# EAGLE design MSP430G2553IN28_Test2 (EAGLE 6.5.0)
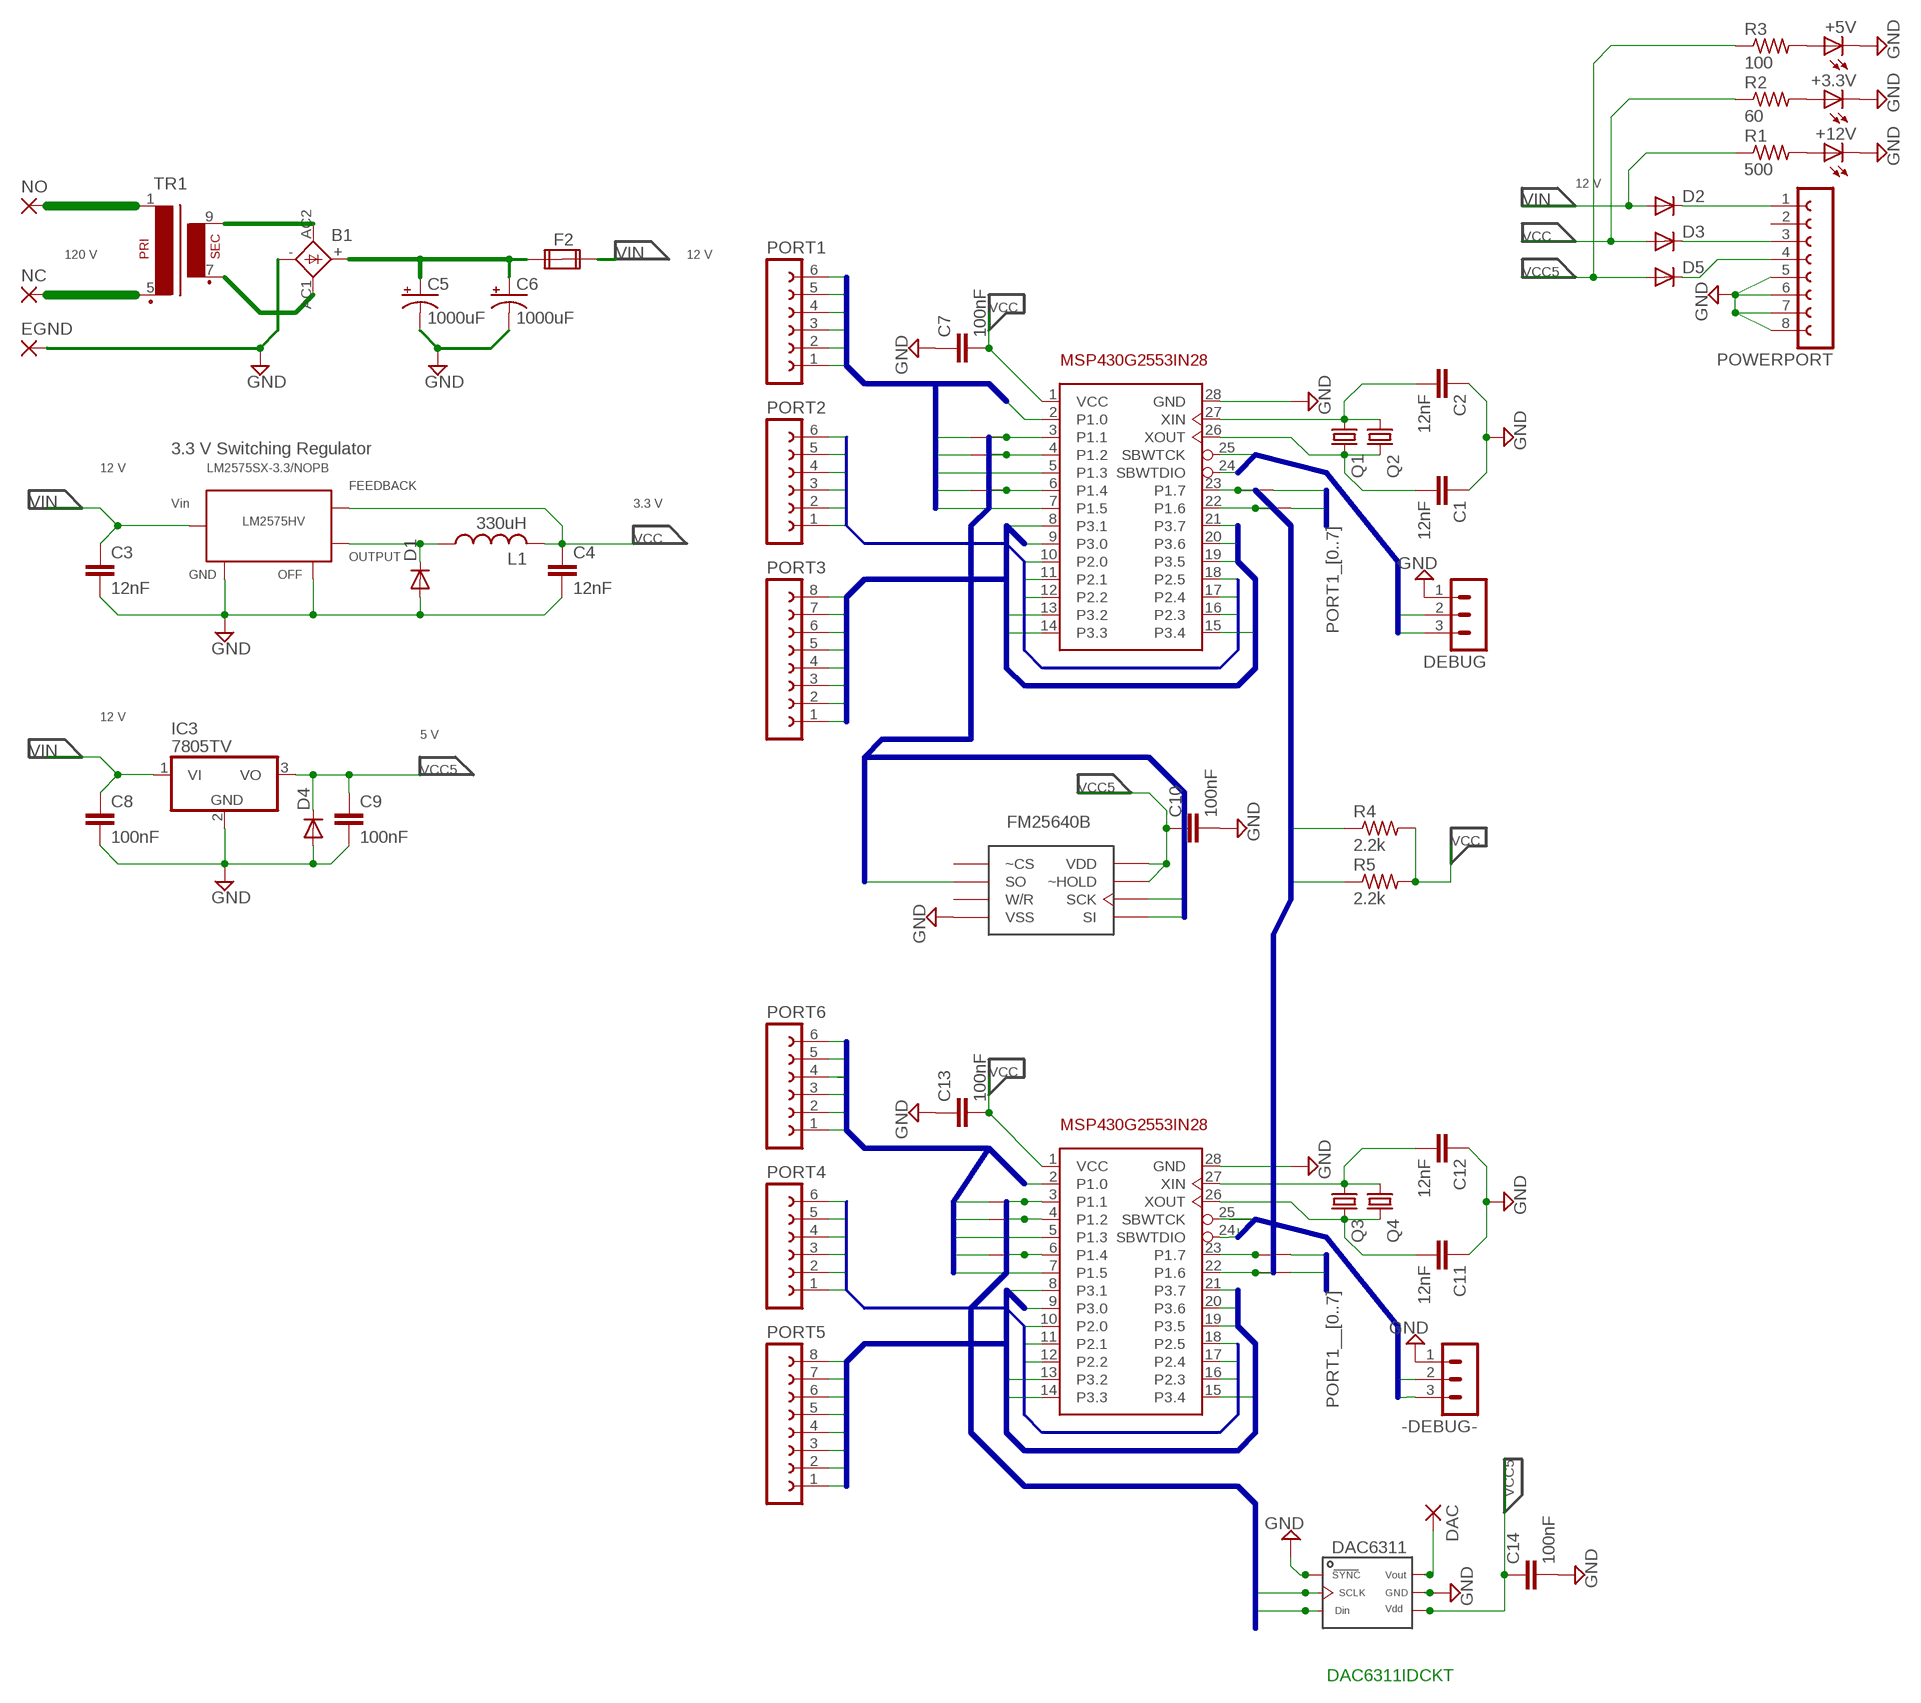
[diagram p0: schematic, sheet 1]

## Parts
+3.3V  LEDSML0603  [SML0603]
+5V  LEDSML0603  [SML0603]
+12V  LEDSML0603  [SML0603]
-DEBUG-  MA03-1  [MA03-1]
B1  GBU4  [GBU4S]
C1  12nF  C-EUC0402  [C0402]
C2  12nF  C-EUC0402  [C0402]
C3  12nF  C-EUC0402  [C0402]
C4  12nF  C-EUC0402  [C0402]
C5  1000uF  CPOL-USE5-8.5  [E5-8,5]
C6  1000uF  CPOL-USE5-8.5  [E5-8,5]
C7  100nF  C-EUC0402  [C0402]
C8  100nF  C-EUC0402  [C0402]
C9  100nF  C-EUC0402  [C0402]
C10  100nF  C-EUC0402  [C0402]
C11  12nF  C-EUC0402  [C0402]
C12  12nF  C-EUC0402  [C0402]
C13  100nF  C-EUC0402  [C0402]
C14  100nF  C-EUC0402  [C0402]
D1  DIODE-SOD106-R  [SOD106-R]
D2  DIODE-DO41-7.6  [DO41-7.6]
D3  DIODE-DO41-7.6  [DO41-7.6]
D4  DIODE-SOD106-R  [SOD106-R]
D5  DIODE-DO41-7.6  [DO41-7.6]
DAC  1,6/0,8  [1,6/0,8]
DEBUG  MA03-1  [MA03-1]
EGND  3,81/1,4  [3,81/1,4]
F2  FUSE2P  [FUSE1]
IC1  MSP430  [P-TSSOP28-1]
IC2  FM25640BSO8  [SO08]
IC3  7805TV  [TO220V]
IC4  MSP430  [P-TSSOP28-1]
IC5  DAC6311  [SC70-6]
IC6  CUSTOM_REGULATOR  [TO263-5]
L1  330uH  L-USL1812  [L1812]
NC  3,81/1,4  [3,81/1,4]
NO  3,81/1,4  [3,81/1,4]
PORT1  FE06-1  [FE06]
PORT2  FE06-1  [FE06]
PORT3  FE08-1  [FE08]
PORT4  FE06-1  [FE06]
PORT5  FE08-1  [FE08]
PORT6  FE06-1  [FE06]
POWERPORT  FE08-1  [FE08]
Q1  CRYSTALTC26H  [TC26H]
Q2  CRYSTALHC49U-V  [HC49U-V]
Q3  CRYSTALTC26H  [TC26H]
Q4  CRYSTALHC49U-V  [HC49U-V]
R1  500  R-US_R0402  [R0402]
R2  60  R-US_R0402  [R0402]
R3  100  R-US_R0402  [R0402]
R4  2.2k  R-US_R0402  [R0402]
R5  2.2k  R-US_R0402  [R0402]
TR1  VV11  [VV11]
U$1  SHORTSHORT  [SMALLSHORT]
U$6  SHORTSHORT  [SMALLSHORT]
U$7  SHORTSHORT  [SMALLSHORT]
U$8  SHORTSHORT  [SMALLSHORT]
U$9  SHORTSHORT  [SMALLSHORT]
U$10  SHORTSHORT  [SMALLSHORT]
U$11  SHORTSHORT  [SMALLSHORT]
U$12  SHORTSHORT  [SMALLSHORT]
U$13  SHORTSHORT  [SMALLSHORT]
U$14  SHORTSHORT  [SMALLSHORT]
U$15  SHORTSHORT  [SMALLSHORT]

## Nets
DEBUG_P1: DEBUG.2 IC1.25(SBWTCK)
DEBUG_P2: DEBUG.3 IC1.24(SBWTDIO)
DEBUG_P4: -DEBUG-.3 IC4.24(SBWTDIO)
DEBUG_P_2: -DEBUG-.2 IC4.25(SBWTCK)
GND: +3.3V.C +5V.C +12V.C -DEBUG-.1 B1.- C1.1 C2.1 C3.2 C4.2 C5.- C6.- C7.1 C8.2 C9.2 C10.2 C11.1 C12.1 C13.1 C14.2 D1.A D4.A DEBUG.1 EGND.1(P) IC1.28(GND) IC2.4(VSS) IC3.2(GND) IC4.28(GND) IC5.1 IC5.5 IC6.3 IC6.5 IC6.6 POWERPORT.5 POWERPORT.6 POWERPORT.7 POWERPORT.8
I2C0: IC1.23(P1.7) IC4.23(P1.7) R4.1 U$8.1 U$9.1 U$14.1
I2C1: IC1.22(P1.6) IC4.22(P1.6) R5.1 U$10.1 U$15.1
N$1: C2.2 IC1.27(XIN) Q1.1 Q2.1
N$2: C1.2 IC1.26(XOUT) Q1.2 Q2.2
N$3: NC.1(P) TR1.5(P2)
N$4: NO.1(P) TR1.1
N$5: +12V.A R1.2
N$6: +3.3V.A R2.2
N$7: D2.C POWERPORT.1
N$8: D3.C POWERPORT.3
N$9: B1.AC2(AC1) TR1.9(S4)
N$10: B1.AC1(AC2) TR1.7(S3)
N$11: C12.2 IC4.27(XIN) Q3.1 Q4.1
N$12: C11.2 IC4.26(XOUT) Q3.2 Q4.2
N$13: D5.C POWERPORT.4
N$14: +5V.A R3.2
N$15: DAC.1(P) IC5.6
N$33: B1.+ C5.+ C6.+ F2.1A
P$2: D1.C IC6.2 L1.1
PORT1_0: IC1.2(P1.0) PORT1.1
PORT1_1: PORT1.2 U$1.1
PORT1_2: PORT1.3 U$6.1
PORT1_3: IC1.5(P1.3) PORT1.4
PORT1_4: PORT1.5 U$7.1
PORT1_5: IC1.7(P1.5) PORT1.6
PORT1_6: U$10.2
PORT1_7: U$8.2 U$9.2
PORT1__0: IC4.2(P1.0) PORT6.1
PORT1__1: PORT6.2
PORT1__2: PORT6.3
PORT1__3: IC4.5(P1.3) PORT6.4
PORT1__4: PORT6.5
PORT1__5: IC4.7(P1.5) PORT6.6
PORT1__6: U$15.2
PORT1__7: U$14.2
PORT2_0: IC1.10(P2.0) PORT2.1
PORT2_1: IC1.11(P2.1) PORT2.2
PORT2_2: IC1.12(P2.2) PORT2.3
PORT2_3: IC1.16(P2.3) PORT2.4
PORT2_4: IC1.17(P2.4) PORT2.5
PORT2_5: IC1.18(P2.5) PORT2.6
PORT2_6: PORT4.1
PORT2__0: IC4.10(P2.0)
PORT2__1: IC4.11(P2.1) PORT4.2
PORT2__2: IC4.12(P2.2) PORT4.3
PORT2__3: IC4.16(P2.3) PORT4.4
PORT2__4: IC4.17(P2.4) PORT4.5
PORT2__5: IC4.18(P2.5) PORT4.6
PORT3_0: IC1.9(P3.0) PORT3.1
PORT3_1: IC1.8(P3.1) PORT3.2
PORT3_2: IC1.13(P3.2) PORT3.3
PORT3_3: IC1.14(P3.3) PORT3.4
PORT3_4: IC1.15(P3.4) PORT3.5
PORT3_5: IC1.19(P3.5) PORT3.6
PORT3_6: IC1.20(P3.6) PORT3.7
PORT3_7: IC1.21(P3.7) PORT3.8
PORT3__0: IC4.9(P3.0) PORT5.1
PORT3__1: IC4.8(P3.1) PORT5.2
PORT3__2: IC4.13(P3.2) PORT5.3
PORT3__3: IC4.14(P3.3) PORT5.4
PORT3__4: IC4.15(P3.4) PORT5.5
PORT3__5: IC4.19(P3.5) PORT5.6
PORT3__6: IC4.20(P3.6) PORT5.7
PORT3__7: IC4.21(P3.7) PORT5.8
SPI3: IC1.3(P1.1) IC2.2(SO) IC4.3(P1.1) IC5.3 U$1.2 U$11.2
SPI4: IC1.4(P1.2) IC2.5(SI) IC4.4(P1.2) U$6.2 U$12.2
SPI5: IC1.6(P1.4) IC2.6(SCK) IC4.6(P1.4) IC5.2 U$7.2 U$13.2
VCC: C4.1 C7.2 C13.2 D3.A IC1.1(VCC) IC4.1(VCC) IC6.4 L1.2 R2.1 R4.2 R5.2
VCC5: C9.1 C10.1 C14.1 D4.C D5.A IC2.7(~HOLD) IC2.8(VDD) IC3.3(VO) IC5.4 R3.1
VIN: C3.1 C8.1 D2.A F2.2A IC3.1(VI) IC6.1 R1.1
Unconnected: F2.1B F2.2B IC2.1(~CS) IC2.3(W/R) POWERPORT.2 U$11.1 U$12.1 U$13.1

## Buses
PORT1__[0..7]
PORT2__[0..5]
PORT3__[0..7]
DEBUG_P_[0..2]
I2C[0..1]
SPI[3..5]
PORT3_[0..7]
PORT2_[0..5]
PORT1_[0..7]

## Notes on the sheet
- 12 V
- 120 V | 12 V
- 3.3 V Switching Regulator
- 12 V | LM2575SX-3.3/NOPB
- 3.3 V
- 12 V
- 5 V
- DAC6311IDCKT

## Library data of the parts
+3.3V +5V +12V = led:LED: LED OSRAM: - CHIPLED LG R971, LG N971, LY N971, LG Q971, LY Q971, LO R971, LY R971 LH N974, LH R974 LS Q976, LO Q976, LY Q976 LO Q996 - Hyper CHIPLED LW Q18S LB Q993, LB Q99A, LB R99A - SideLED LS A670, LO A670, LY A670, LG A670, LP A670 LB A673, LV A673, LT A673, LW A673 LH A674 LY A675 LS A676, LA A676, LO A676, LY A676, LW A676 LS A679, LY A679, LG A679 - Hyper Micro SIDELED® LS Y876, LA Y876, LO Y876, LY Y876 LT Y87S - SmartLED LW L88C, LW L88S LB L89C, LB L89S, LG L890 LS L89K, LO L89K, LY L89K LS L896, LA L896, LO L896, LY L896 - TOPLED LS T670, LO T670, LY T670, LG T670, LP T670 LSG T670, LSP T670, LSY T670, LOP T670, LYG T670 LG T671, LOG T671, LSG T671 LB T673, LV T673, LT T673, LW T673 LH T674 LS T676, LA T676, LO T676, LY T676, LB T676, LH T676, LSB T676, LW T676 LB T67C, LV T67C, LT T67C, LS T67K, LO T67K, LY T67K, LW E67C LS E67B, LA E67B, LO E67B, LY E67B, LB E67C, LV E67C, LT E67C LW T67C LS T679, LY T679, LG T679 LS T770, LO T770, LY T770, LG T770, LP T770 LB T773, LV T773, LT T773, LW T773 LH T774 LS E675, LA E675, LY E675, LS T675 LS T776, LA T776, LO T776, LY T776, LB T776 LHGB T686 LT T68C, LB T68C - Hyper Mini TOPLED® LB M676 - Mini TOPLED Santana® LG M470 LS M47K, LO M47K, LY M47K Source: http://www.osram.convergy.de LUXEON: - LUMILED® LXK2-PW12-R00, LXK2-PW12-S00, LXK2-PW14-U00, LXK2-PW14-V00 LXK2-PM12-R00, LXK2-PM12-S00, LXK2-PM14-U00 LXK2-PE12-Q00, LXK2-PE12-R00, LXK2-PE12-S00, LXK2-PE14-T00, LXK2-PE14-U00 LXK2-PB12-K00, LXK2-PB12-L00, LXK2-PB12-M00, LXK2-PB14-N00, LXK2-PB14-P00, LXK2-PB14-Q00 LXK2-PR12-L00, LXK2-PR12-M00, LXK2-PR14-Q00, LXK2-PR14-R00 LXK2-PD12-Q00, LXK2-PD12-R00, LXK2-PD12-S00 LXK2-PH12-R00, LXK2-PH12-S00 LXK2-PL12-P00, LXK2-PL12-Q00, LXK2-PL12-R00 Source: www.luxeon.com KINGBRIGHT: KA-3528ASYC Source: www.kingbright.com
-DEBUG- DEBUG = con-lstb:MA03-1: PIN HEADER; OC_FARNELL: unknown; OC_NEWARK: unknown
B1 = rectifier:GBU4: GENERAL INSTRUMENT RECTIFIER
C1-C4 C7-C14 = rcl:C-EU: CAPACITOR, European symbol
C5 C6 = rcl:CPOL-US: POLARIZED CAPACITOR, American symbol
D1-D5 = diode:DIODE-: DIODE
DAC = wirepad:1,6/0,8: THROUGH-HOLE PAD
EGND NC NO = wirepad:3,81/1,4: THROUGH-HOLE PAD
F2 = special:FUSE2P: FUSE 5 x 20 mm
IC1 IC4 = msp430_board:MSP430: Custom MSP430
IC2 = msp430_board:FM25640B: Custom RAM
IC3 = linear:78*: Positive VOLTAGE REGULATOR Source: http://cache.national.com/ds/LM/LM78L05.pdf http://www.fairchildsemi.com/ds/LM/LM7805.pdf
IC5 = msp430_board:DAC6311: Custom DAC
IC6 = msp430_board:CUSTOM_REGULATOR: Custom LM2575
L1 = rcl:L-US: INDUCTOR, American symbol
PORT1 PORT2 PORT4 PORT6 = con-lsta:FE06-1: FEMALE HEADER; OC_FARNELL: unknown; OC_NEWARK: unknown
PORT3 PORT5 POWERPORT = con-lsta:FE08-1: FEMALE HEADER; OC_FARNELL: unknown; OC_NEWARK: unknown
Q1 Q3 = crystal:CRYSTAL: CRYSTAL; OC_FARNELL: unknown; OC_NEWARK: unknown
Q2 Q4 = crystal:CRYSTAL: CRYSTAL; OC_FARNELL: 1666969; OC_NEWARK: unknown
R1-R5 = rcl:R-US_: RESISTOR, American symbol
TR1 = trafo:VV11: TRANSFORMER 1 primary winding, 1 secondary winding BLOCK
U$1 U$6-U$15 = msp430_board:SHORT: Custom SHORT

## Board
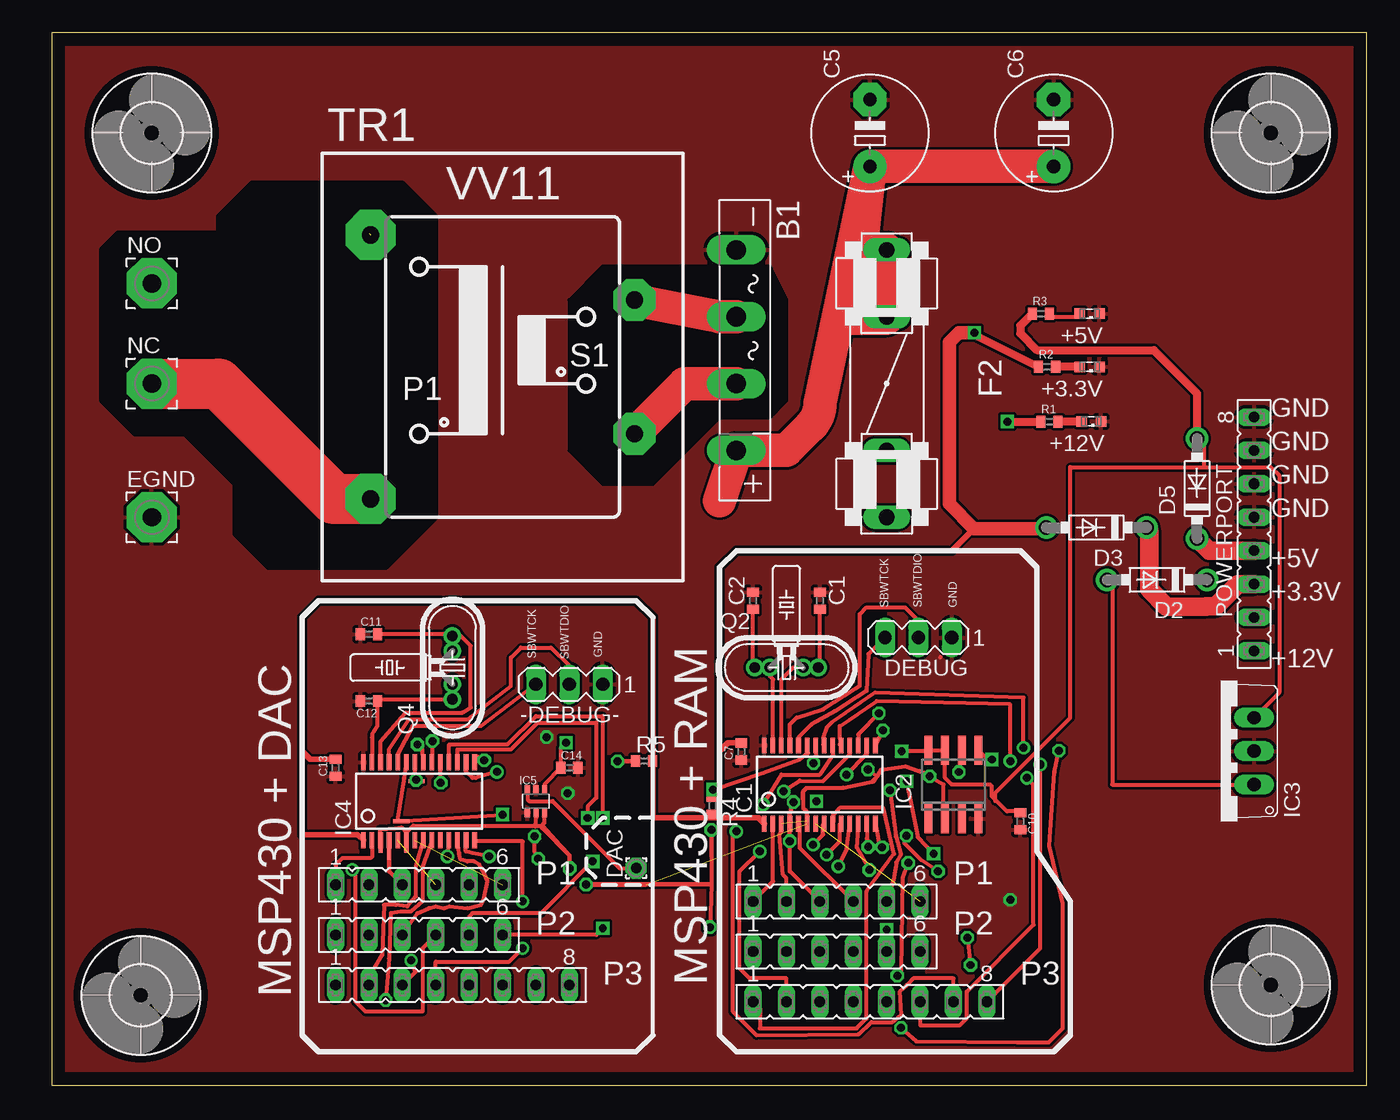
[diagram p1: board, top side]
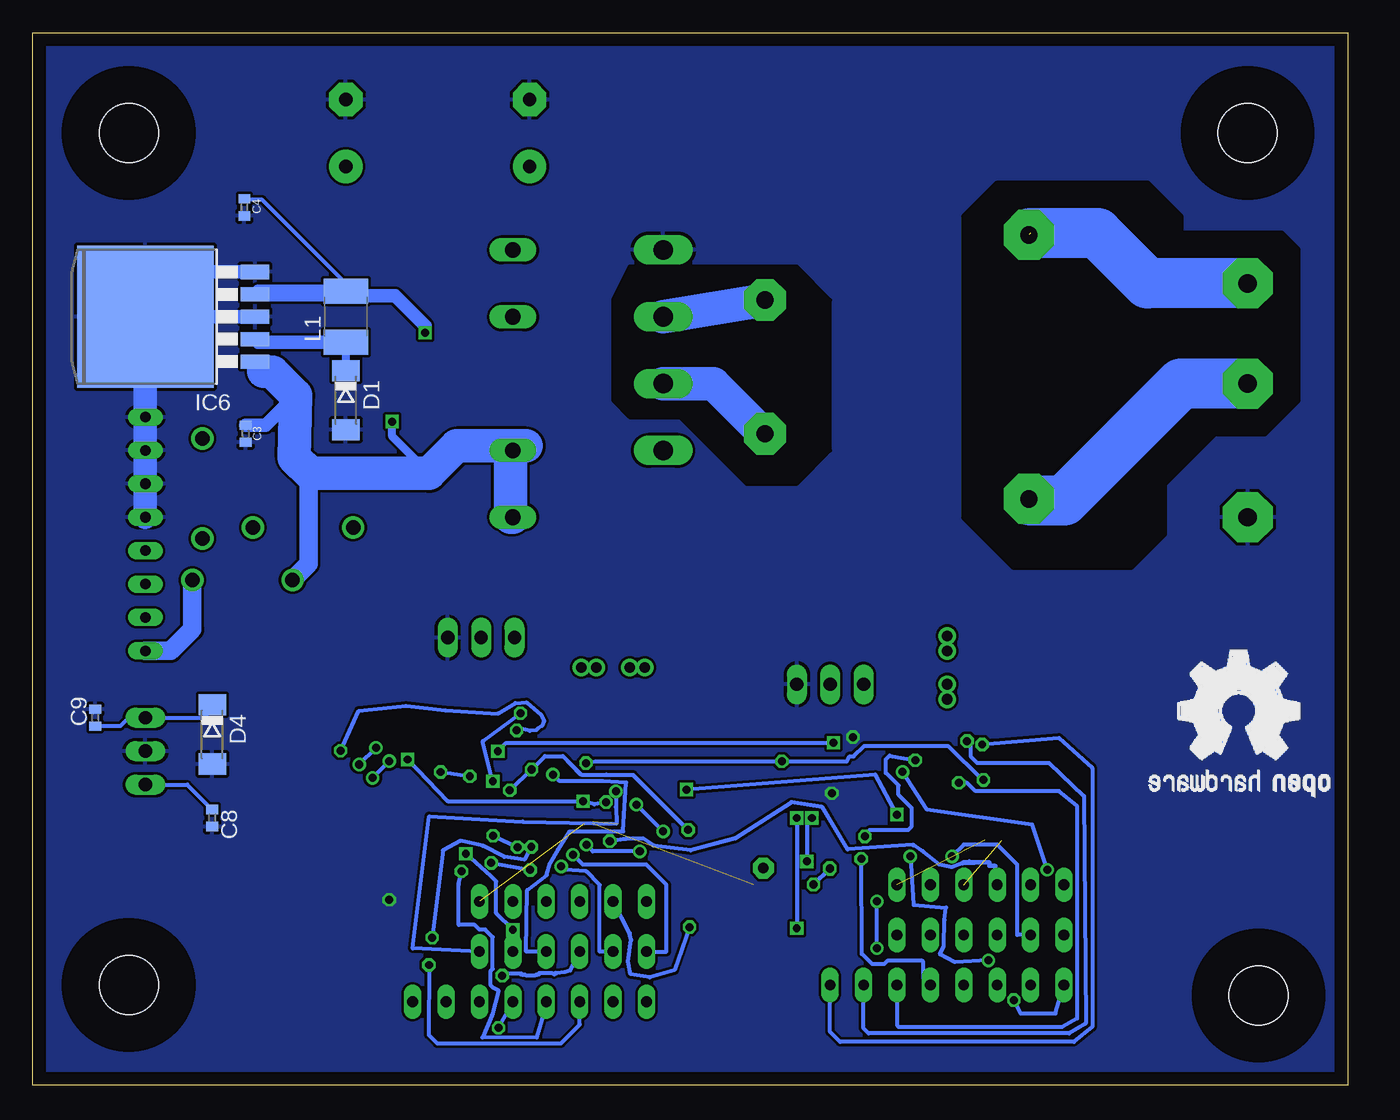
[diagram p2: board, bottom side, seen from below]

Size 100 x 80 mm. Coordinates in mm from the lower left corner, seen from the top.
Outline: 0,0 100,0 100,80 0,80 0,0
Copper layers (1*16): Top 0.035mm / dielectric 1.5mm / Bottom 0.035mm
Design rules "default *": minimum track width 0.3mm, minimum drill 24mil, track to track 8mil, track to pad 8mil, pad to pad 8mil, via to via 8mil, smd to smd 8mil, copper to edge 40mil, drill to drill 0.2432mm, minimum pad ring 10mil, minimum via ring 8mil, stop-mask expansion 4mil, vias tented up to drill 0mil, thermal gap 10mil
tRestrict: area 3.8,39.4 to 29.2,68.6; area 39.4,45.7 to 55.9,62.2
bRestrict: area 3.8,39.4 to 29.2,68.6; area 39.4,45.7 to 55.9,62.2

### Footprints (pad centres in the part's own frame; a part is rotated, then mirrored left to right if it is on the bottom)
SML0603 = smd 0.8 x 0.8: A 0.75,0; C -0.75,0
MA03-1 = drill 1.016 long: 1 -2.54,0; 2 0,0; 3 2.54,0
GBU4S = drill 1.499 long: + 7.62,0; - -7.62,0; AC1 2.54,0; AC2 -2.54,0
C0402 = smd 0.7 x 0.9: 1 -0.65,0; 2 0.65,0
E5-8,5 = drill 1.016 pad 2.54: + -2.54,0 | drill 1.016 pad 2.54 octagon: - 2.54,0
SOD106-R = smd 1.6 x 2.1: A 2.25,0; C -2.25,0
DO41-7.6 = drill 1.1 pad 1.7: A 3.81,0; C -3.81,0
1,6/0,8 = drill 0.813 pad 1.6 octagon: 1 0,0
3,81/1,4 = drill 1.397 pad 3.81 octagon: 1 0,0
FUSE1 = drill 1.194 long: 1A -10.16,0; 1B -5.08,0; 2A 10.16,0; 2B 5.08,0
P-TSSOP28-1 = smd 0.35 x 1.2: 1 -4.225,-2.975; 2 -3.575,-2.975; 3 -2.925,-2.975; 4 -2.275,-2.975; 5 -1.625,-2.975; 6 -0.975,-2.975; 7 -0.325,-2.975; 8 0.325,-2.975; 9 0.975,-2.975; 10 1.625,-2.975; 11 2.275,-2.975; 12 2.925,-2.975; 13 3.575,-2.975; 14 4.225,-2.975; 15 4.225,2.975; 16 3.575,2.975; 17 2.925,2.975; 18 2.275,2.975; 19 1.625,2.975; 20 0.975,2.975; 21 0.325,2.975; 22 -0.325,2.975; 23 -0.975,2.975; 24 -1.625,2.975; 25 -2.275,2.975; 26 -2.925,2.975; 27 -3.575,2.975; 28 -4.225,2.975
SO08 = smd 0.6 x 2.2: 1 -1.905,-2.6; 2 -0.635,-2.6; 3 0.635,-2.6; 4 1.905,-2.6; 5 1.905,2.6; 6 0.635,2.6; 7 -0.635,2.6; 8 -1.905,2.6
TO220V = drill 1.016 long: 1 -2.54,-2.54; 2 0,-2.54; 3 2.54,-2.54
SC70-6 = smd 0.4 x 0.7: 1 -0.65,-0.85; 2 0,-0.85; 3 0.65,-0.85 | smd 0.406 x 0.711: 4 0.66,0.864; 5 0,0.864; 6 -0.66,0.864
TO263-5 = smd 1.067 x 2.159: 1 -3.404,-5.791; 2 -1.702,-5.791; 3 0,-5.791; 4 1.702,-5.791; 5 3.404,-5.791 | smd 10.8 x 10.41: 6 0,2.54
L1812 = smd 1.9 x 3.4: 1 -1.95,0; 2 1.95,0
FE06 = drill 0.813 long: 1 -6.35,0; 2 -3.81,0; 3 -1.27,0; 4 1.27,0; 5 3.81,0; 6 6.35,0
FE08 = drill 0.813 long: 1 -8.89,0; 2 -6.35,0; 3 -3.81,0; 4 -1.27,0; 5 1.27,0; 6 3.81,0; 7 6.35,0; 8 8.89,0
TC26H = drill 0.813: 1 -1.27,0; 2 1.27,0
HC49U-V = drill 0.813: 1 -2.413,0; 2 2.413,0
R0402 = smd 0.7 x 0.9: 1 -0.65,0; 2 0.65,0
VV11 = drill 1.321 pad 3.81 octagon: 1 -10.033,10.033; 5 -10.033,-10.033 | drill 1.321 pad 3.175 octagon: 7 10.033,-5.08; 9 10.033,5.08
SMALLSHORT = smd 0.61 x 0.305: 1 -0.305,0; 2 0.305,0
4,5 = hole 4.5: 0,0

### Placement (x,y rotation side)
+3.3V  78.93,54.61 180 top
+5V  78.93,58.65 180 top
+12V  79.06,50.47 180 top
-DEBUG-  39.37,30.48 180 top
B1  52.07,55.88 270 top
C1  58.42,36.83 270 top
C2  53.34,36.83 270 top
C3  83.82,49.53 270 bottom
C4  83.91,66.73 270 bottom
C5  62.23,72.39 90 top
C6  76.2,72.39 90 top
C7  52.45,25.37 90 top
C8  86.36,20.32 270 bottom
C9  95.25,27.94 90 bottom
C10  73.66,20.07 270 top
C11  24.13,34.29 0 top
C12  24.13,29.21 0 top
C13  21.59,24.13 90 top
C14  39.37,24.13 0 top
D1  76.2,52.07 270 bottom
D2  84.06,38.42 180 top
D3  79.45,42.39 180 top
D4  86.36,26.67 270 bottom
D5  87.1,45.37 90 top
DAC  44.45,16.51 90 top
DEBUG  65.91,34.04 180 top
EGND  7.62,43.18 0 top
F2  63.5,53.34 270 top
IC1  58.42,22.86 0 top
IC2  68.58,22.86 0 top
IC3  88.9,25.4 90 top
IC4  27.94,21.59 0 top
IC5  36.83,21.59 0 top
IC6  88.9,58.42 90 bottom
L1  76.2,58.42 90 bottom
NC  7.62,53.34 0 top
NO  7.62,60.96 0 top
PORT1  59.69,13.97 0 top
PORT2  59.69,10.16 0 top
PORT3  62.23,6.35 0 top
PORT4  27.94,11.43 0 top
PORT5  30.48,7.62 0 top
PORT6  27.94,15.24 0 top
POWERPORT  91.44,41.91 90 top
Q1  55.88,31.75 0 top
Q2  55.88,31.75 0 top
Q3  30.48,31.75 90 top
Q4  30.48,31.75 90 top
R1  75.88,50.44 0 top
R2  75.7,54.61 0 top
R3  75.22,58.65 0 top
R4  50.27,21.26 270 top
R5  45.06,24.65 0 top
TR1  34.29,54.61 0 top
U$1  55.91,13.87 270 top
U$2  [4,5]  6.78,6.83 0 top
U$3  [4,5]  7.62,72.39 0 top
U$4  [4,5]  92.71,72.39 0 top
U$5  [4,5]  92.71,7.62 0 top
U$6  25.65,18.29 90 top
U$7  26.97,18.32 90 top
U$8  26.59,20.07 0 top
U$9  26.61,20.07 0 top
U$10  27.75,23.12 0 top
U$11  25.01,18.27 90 top
U$12  25.66,17.74 90 top
U$13  26.98,18.29 90 top
U$14  26.6,20.08 0 top
U$15  27.74,23.11 0 top

### Tracks (layer width: path | path; a pad name or v marks a point on that pad's centre or on a via)
DEBUG_P1
  Top 0.305: IC1.25 56.13,25.85 56.13,27.43 56.64,27.94 58.67,28.57 61.47,30.35 61.47,35.81 61.98,36.32 64.9,36.32 65.91,35.31 DEBUG.2
DEBUG_P2
  Top 0.305: DEBUG.3 62.1,32.77 61.98,29.97 59.56,28.45 57.78,27.43 56.8,26.44 IC1.24
DEBUG_P4
  Top 0.305: -DEBUG-.3 32.64,27.3 27.43,27.3 26.32,25.17 IC4.24
DEBUG_P_2
  Top 0.3: 25.65,24.64 IC4.25
  Top 0.305: 25.65,24.58 25.65,24.64 25.65,25.53 27.18,27.81 31.62,27.81 34.92,30.35 34.92,32.51 35.69,33.27 37.97,33.27 39.37,31.88 -DEBUG-.2
GND  (via drill 0.6)
  Top 0.3: 40.13,24.13 C14.2 | 67.61,32.56 67.56,32.52
  Bottom 0.406: IC6.3 83.14,58.45 87.63,58.45 86.91,59.17 86.91,61.82
  Bottom 1.016: IC6.6 IC6.3 | 86.91,61.82 IC6.5
  Bottom 1.778: IC6.6 POWERPORT.5
  other vias: 39.25,22.2 72.9,14.1 37.63,26.47
  pour Top: -0.13,0 0,0.13 0,80.01 0.25,79.76 99.82,79.76 103.76,79.76 104.14,79.38 104.14,77.47 99.95,77.47 99.95,0 99.82,-0.13 0,-0.13
  pour Bottom: 99.95,75.44 100.08,75.31 106.68,75.31 106.81,75.18 106.81,72.9 106.43,72.52 99.95,72.52 99.95,-0.38 99.57,0 0,0 0,80.01 99.95,80.14
I2C0  (via drill 0.6)
  Top 0.305: IC4.23 26.8,23.37 U$8.1 | U$8.1 v34.29,20.57 | IC1.23 57.53,25.27 56.9,24.77 54.1,23.75 v50.29,22.48 R4.1 | U$8.1 U$9.1 U$8.1 U$14.1
  Bottom 0.305: v34.29,20.57 35.94,23.62 v50.29,22.48
I2C1  (via drill 0.6, 0.61)
  Top 0.3: v27.71,23.22 27.64,23.52 27.64,24.16 IC4.22 | v57.94,24.49 58.12,25.04 58.12,25.81 IC1.22
  Top 0.305: v27.71,23.22 U$10.1 U$15.1 | 43.71,24.64 v43.04,24.63 R5.1 | 43.71,24.64 43.38,24.64 | 43.71,24.64 44.25,24.64
  Bottom 0.3: v27.71,23.22 27.34,23.27 27.84,23.27 30.43,25.81 36.78,25.81 37.59,24.99 37.9,24.99 38.09,24.62 41.38,24.62 57.24,24.62 v57.94,24.49
  Bottom 0.305: v43.04,24.63 41.38,24.62
N$1
  Top 0.305: IC1.27 54.86,25.85 54.86,30.86 54.61,31.11 Q1.1 Q2.1 53.34,31.88 C2.2
N$2
  Top 0.305: IC1.26 55.5,30.86 56.39,31.75 Q1.2 Q2.2 58.42,31.88 C1.2
N$3
  Top 3.81: NC.1 12.7,53.34 21.46,44.58 TR1.5
  Bottom 3.81: NC.1 12.7,53.34 21.59,44.45 24.13,44.45
N$4  (1 unrouted)
  Bottom 3.81: NO.1 15.24,60.96 19.05,64.77 24.13,64.77
N$5
  Top 0.61: +12V.A 78.28,50.44 R1.2
N$6
  Top 0.61: +3.3V.A R2.2
N$7
  Bottom 1.422: POWERPORT.1 89.51,33.01 87.87,34.65 D2.C
N$8
  Top 1.422: D3.C 83.46,42.2 83.46,37.69 84.77,36.38 87.77,36.38 87.82,36.43 88.53,36.43 90.2,38.1 POWERPORT.3
N$9
  Top 2.54: TR1.9 50.8,58.42 B1.AC2
  Bottom 2.54: 44.45,59.69 B1.AC2
N$10
  Top 2.54: TR1.7 48.13,53.34 B1.AC1
  Bottom 2.54: 44.45,49.53 48.26,53.34 B1.AC1
N$11
  Top 0.305: Q4.1 24.91,29.34 C12.2 24.77,28.46 24.77,27.3 24.38,26.67 24.36,26.43 IC4.27
  Bottom 0.305: Q3.1 Q4.1
N$12
  Top 0.305: C11.2 30.35,34.29 Q4.2 31.11,34.16 31.88,33.4 31.88,28.7 31.24,28.32 26.92,28.32 25.02,26.16 IC4.26
  Bottom 0.305: Q4.2 Q3.2
N$13
  Top 1.422: D5.C 88.02,40.64 POWERPORT.4
N$14
  Top 0.3: +5V.A 78.11,58.42 76.2,58.42 R3.2
N$15
  Top 0.305: IC5.6 36.2,22.43 36.2,21.72 36.32,21.59 38.1,21.59 43.18,16.51 DAC.1
N$16
  Top 0.305: 57.4,25.65 57.4,25.15
N$17
  Bottom 0.305: 26.66,15.23 26.8,15.23 26.8,16.68 27.27,16.68 27.27,16.95 29.28,16.95 29.28,16.87
N$18
  Bottom 0.305: 28.77,17.02 28.81,17.02 28.81,16.94 27.24,16.94 27.24,16.95 27.26,16.95 27.26,16.68 26.81,16.68 26.81,16.62 26.8,16.62 26.8,15.23 26.65,15.23
N$19
  Top 0.305: 26.69,15.23 25.66,16.26 25.66,18.14
N$33
  Top 2.54: C5.+ C6.+ | 50.8,44.45 B1.+ 55.88,48.26 57.68,50.06 arc45 58.42,51.85 C5.+ | C5.+ 60.97,58.32 63.5,58.32 F2.1A
P$2
  Bottom 0.61: L1.1 D1.C
  Bottom 1.016: IC6.2 82.86,56.47 L1.1
PORT1_0
  Top 0.3: PORT1.1 54.86,15.49 54.86,19.81 IC1.2
PORT1_1
  Top 0.3: 55.47,19.86 55.47,19.25 55.34,19.03 55.63,16 55.88,15.75 PORT1.2
  Top 0.305: PORT1.2 U$1.1
PORT1_2  (via drill 0.6)
  Top 0.3: v56.14,18.56 56.13,16.26 PORT1.3 | 56.13,19.48 56.17,19.91
  Top 0.305: v56.14,18.56 56.13,19.48 | U$6.1 25.66,16.27 v26.72,15.24
  Bottom 0.305: v56.14,18.56 54.67,18.74 53.59,18.77 52.76,18.21 49.97,17.86 46.61,18.75 42.28,21.52 39.98,21.15 38.07,17.95 33.08,18.27 32.35,17.8 31.05,16.77 30.12,16.59 29.32,16.87 27.26,16.93 27.24,16.69 26.82,16.68 26.77,16.06 v26.72,15.24
PORT1_3
  Top 0.3: PORT1.4 56.9,18.03 56.9,19.81 IC1.5
PORT1_4  (via drill 0.6)
  Top 0.305: U$7.1 26.98,19.27 27.5,19.73 37.24,19.72 39.37,17.48 v39.4,16.49 | v40.64,15.24 50.2,15.27 v50.17,19.4 | v63.74,22.42 64.19,18.93 64.58,17.52 64.23,16.93 64.02,15.63 PORT1.5
  Bottom 0.305: v39.4,16.49 39.37,16.51 v40.64,15.24 | v50.17,19.4 54.37,23.58 58.35,23.62 59.69,25 61.08,24.98 62.07,24 v63.74,22.42
PORT1_5  (1 unrouted)
PORT1_7
  Top 0.305: U$9.2 U$8.2
PORT1__0
  Top 0.305: IC4.2 24.38,18.6 24.38,17.4 24.26,17.27 22.1,17.27 21.59,16.76 PORT6.1
PORT1__2
  Top 0.305: 25.65,18.6 25.65,16.26 PORT6.3
PORT1__3  (1 unrouted)
PORT1__5  (1 unrouted)
PORT2_0  (via drill 0.61)
  Top 0.3: v58.93,17.53 59.94,18.54 59.94,19.81 IC1.10
  Bottom 0.3: v58.93,17.53 58.17,16.76 53.34,16.76 51.82,15.24 51.82,10.16 PORT2.1
PORT2_1  (via drill 0.61)
  Top 0.3: 60.71,19.81 IC1.11
  Top 0.305: v59.82,16.64 60.45,17.91 IC1.11
  Bottom 0.3: v59.82,16.64 59.56,16.38 57.91,16.26 56.9,15.24 56.9,10.16 PORT2.2
PORT2_2  (via drill 0.61)
  Top 0.3: v62.18,16.37 61.24,18.06 61.3,19.04 61.37,19.86 IC1.12 | v65.15,16.91 64.73,15.77 64.62,8.64 v64.31,8.33
  Bottom 0.3: v65.15,16.91 v62.18,16.37 | v64.31,8.33 64.21,8.43 64.06,8.43 63.93,8.48 62.86,8.48 62.89,8.43 62.79,8.43 62.74,8.38 62.53,8.38 62.48,8.33 61.82,8.33 61.77,8.38 61.67,8.38 61.62,8.43 61.52,8.43 61.53,8.5 60.47,8.5 60.35,8.43 60.28,8.55 60.23,8.5 60.19,8.51 59.56,8.59 59.13,8.71
  Bottom 0.305: 59.13,8.71 PORT2.3
PORT2_3  (via drill 0.61)
  Top 0.3: v60.45,23.62 61.98,25.15 61.98,25.65 IC1.16
  Bottom 0.3: v60.45,23.62 59.94,23.11 56.64,23.11 54.88,23.01 55.12,19.3 59.18,19.3 | 62.4,14.83 62.48,10.16 PORT2.4
  Bottom 0.305: 62.4,14.83 60.93,15.97 60.68,16.86 60.07,17.91 59.18,19.3
PORT2_4  (via drill 0.6)
  Top 0.305: PORT2.5 v63.5,11.81 | v67.07,17.6 65.87,18.87 65.87,19 v65.02,23.11 | v62.92,28.28 61.34,26.67 IC1.17
  Bottom 0.305: v63.5,11.81 64.77,13.08 64.77,15.49 65.15,15.88 v67.07,17.6 | v65.02,23.11 65.79,26.16 v62.92,28.28
PORT2_5  (via drill 0.61)
  Top 0.3: v55.67,22.34 56.91,23.15 58.67,23.11 60.71,25.15 60.71,25.65 IC1.18
  Bottom 0.3: 55.62,19.89 62.76,20.04 69.85,20.45 71.12,10.41 PORT2.6
  Bottom 0.305: v55.67,22.34 55.66,21.15 55.62,19.89
PORT2__1  (via drill 0.61)
  Top 0.3: v30.1,17.4 30.23,18.54 IC4.11
  Bottom 0.3: v30.1,17.4 29.21,18.29 26.67,18.29 25.15,16.76 25.15,11.43 PORT4.2
PORT2__2
  Top 0.305: PORT4.3 27.81,13.08 28.7,13.46 29.21,13.59 29.84,13.46 30.23,13.59 31.62,13.46 32.64,13.72 32.89,14.22 33.15,15.49 32.89,16.13 32.51,16.76 32.13,17.02 31.62,17.02 31.11,17.14 30.99,17.65 IC4.12
PORT2__3  (via drill 0.61)
  Top 0.3: v33.86,23.82 32.26,23.37 32,23.37 31.5,23.88 31.5,24.38 IC4.16 | v22.86,16.38 23.11,16.51 23.11,6.35 23.88,5.59 28.19,5.59 28.19,10.41 PORT4.4
  Bottom 0.3: v33.86,23.82 32,20.95 24,19.81 v22.86,16.38
PORT2__4  (via drill 0.6)
  Top 0.3: IC4.17 30.89,24.59 30.86,24.59
  Top 0.305: IC4.17 30.86,24.59 30.86,25.53 34.92,25.53 36.96,27.56 41.4,27.56 41.4,21.84 40.77,21.21 v40.77,20.32 | v41.15,17.02 37.21,13.08 32,13.08 31.75,12.83 PORT4.5
  Bottom 0.305: v40.77,20.32 41.15,19.94 v41.15,17.02
PORT2__5  (via drill 0.6)
  Top 0.3: 30.23,24.64 IC4.18
  Top 0.305: 30.23,24.58 30.23,24.64 30.23,25.91 34.67,25.91 36.83,28.07 41.91,28.07 v41.91,20.32 | v41.91,11.94 41.4,11.43 PORT4.6
  Bottom 0.305: v41.91,20.32 v41.91,11.94
PORT3_0
  Top 0.3: PORT3.1 53.85,5.84 53.85,4.32 61.21,4.32 61.98,5.08 61.98,14.73 64.06,17.59 63.25,21.08 59.94,21.08 59.44,20.57 59.44,20.07 IC1.9
PORT3_1  (via drill 0.61)
  Top 0.3: v57.91,18.29 58.67,19.05 58.67,19.81 IC1.8 | v53.85,17.78 52.32,16.26 52.32,8.89 53.09,8.13 55.88,8.13 PORT3.2
  Bottom 0.3: v57.91,18.29 57.4,17.78 v53.85,17.78
PORT3_2  (via drill 0.6)
  Top 0.305: IC1.13 62,18.77 v62.1,18.12 | v69.63,11.22 v69.88,9.14
  Bottom 0.305: v62.1,18.12 62.62,17.14 64.14,17.36 65.78,18.2 67.48,18.57 68.81,17.86 v69.63,11.22 | v69.88,9.14 69.9,3.84 69.25,3.19 59.84,3.19 58.42,4.61 PORT3.3
PORT3_3  (via drill 0.61)
  Top 0.3: v65,18.97 64.85,18.41 66.14,17.12 v67.41,16.27
  Top 0.305: IC1.14 62.88,18.61 v63.15,18.1
  Bottom 0.3: v65,18.97 v63.15,18.1 | v67.41,16.27 67.61,15.27 67.61,12.19 66.4,12.19 66.04,11.84 65.61,11.84 65.02,11.25 65.02,8.84 65.18,8.69 65.18,7.59 65.02,7.44 | 65.81,3.63 61.69,3.65 60.96,6.07 PORT3.4
  Bottom 0.305: 65.02,7.44 64.6,7.21 65.1,5.33 65.81,3.63
PORT3_4  (via drill 0.6)
  Top 0.305: v64.59,4.36 65.76,3.34 73.42,3.26 75.83,3.26 76.89,4.32 76.89,13.82 75.86,18.2 76.27,23.79 v76.6,25.44 | v63.22,26.98 IC1.15
  Bottom 0.305: PORT3.5 v64.59,4.36 | v76.6,25.44 75.22,28.47 71.63,28.85 68.63,28.5 64.63,28.26 63.3,29.04 62.46,29.11 61.36,28.17 61.12,27.7 61.28,27.32 61.61,27.11 61.72,27 62.19,26.93 62.89,27.11 v63.22,26.98
PORT3_5  (via drill 0.61)
  Top 0.3: 59.94,26.42 59.94,25.91 IC1.19 | 62.74,29.21 72.9,28.96 v72.9,24.64 | v74.17,23.37 74.68,22.86 74.68,12.19 69.6,7.11 69.6,5.08 69.09,4.57 66.04,4.57 PORT3.6
  Top 0.305: 59.94,26.42 59.94,27.3 62.74,29.21
  Bottom 0.3: v74.17,23.37 v72.9,24.64
PORT3_6  (via drill 0.61)
  Top 0.3: v54.1,21.34 55.5,23.62 58.42,23.62 59.44,25.15 59.44,25.65 IC1.20 | v52.07,19.3 51.82,19.05 51.82,5.59 53.59,3.81 | 65.02,7.62 65.53,8.13 68.58,8.13 PORT3.7
  Top 0.305: 53.59,3.81 61.38,3.89 62.35,4.8 63.95,4.8 64.63,5.37 64.53,7.17 65.02,7.62
  Bottom 0.3: v52.07,19.3 v54.1,21.34
PORT3_7  (via drill 0.61)
  Top 0.3: v73.91,25.65 73.91,29.46 62.61,29.84 59.31,27.56 58.93,27.18 58.67,26.42 58.67,25.91 IC1.21 | v75.18,24.38 75.18,10.41 PORT3.8
  Bottom 0.3: v75.18,24.38 v73.91,25.65
PORT3__0  (via drill 0.6)
  Top 0.305: IC4.9 28.19,16.64 28.19,13.97 27.3,13.21 26.54,13.21 25.78,13.08 25.65,9.65 v25.4,6.48
  Bottom 0.305: v25.4,6.48 24.89,5.46 22.23,5.46 PORT5.1
PORT3__1
  Top 0.305: IC4.8 27.69,16.64 27.69,14.35 27.05,13.59 26.16,13.72 25.27,13.72 25.15,9.91 24.13,8.26 PORT5.2
PORT3__2  (via drill 0.61)
  Top 0.3: 27.34,9.47 27.69,8.64 PORT5.3 | 31.5,18.54 IC4.13
  Top 0.305: 27.34,9.47 27.37,9.54 27.35,9.49 27.34,9.48 27.38,9.45 v27.34,9.5 | v33.27,17.4 32,17.65 31.5,17.78 IC4.13
  Bottom 0.305: v33.27,17.4 33.02,13.72 30.56,13.49 30.68,12.58 30.73,10.62 31.01,9.94 29.89,9.36 v27.34,9.5
PORT3__3  (via drill 0.61)
  Top 0.3: v35.81,13.97 35.81,18.54 32.26,18.54 IC4.14 | v35.81,10.41 34.8,9.4 29.21,9.4 PORT5.4
  Bottom 0.3: v35.81,10.41 v35.81,13.97
PORT3__4  (via drill 0.6)
  Top 0.305: v37.01,17.21 36.71,17.76 v36.73,18.92 | v32.9,24.71 33.03,24.84 32.18,25.02 32.16,24.82 IC4.15
  Bottom 0.305: PORT5.5 32.29,8.16 32.29,9.38 32.37,9.46 35.03,9.46 35.27,9.21 36.17,9.21 36.96,10 v37.01,17.21 | v36.73,18.92 36.36,19.42 33.43,19.42 33.15,19.7 33.15,21.06 34.17,22.08 34.17,22.79 35.13,23.75 35.13,24.77 34.86,25.05 v32.9,24.71
PORT3__5  (via drill 0.6)
  Top 0.305: v29.59,22.99 29.57,23.01 IC4.19
  Bottom 0.305: PORT5.6 34.29,4.57 34.16,4.45 21.72,4.45 20.57,5.08 20.57,21.21 21.97,22.35 28.32,22.35 28.96,22.99 v29.59,22.99
PORT3__6  (via drill 0.6)
  Top 0.305: IC4.20 28.96,24.61 v28.96,26.16
  Bottom 0.305: v28.96,26.16 28.7,25.91 28.7,25.02 28.19,24.51 22.73,24.51 20.07,21.97 19.94,4.7 21.21,3.94 36.45,3.94 36.83,4.32 PORT5.7
PORT3__7  (via drill 0.6)
  Top 0.305: IC4.21 28.19,25.53 v27.81,25.91
  Bottom 0.305: v27.81,25.91 21.97,26.42 19.43,24.13 19.43,4.45 20.83,3.3 38.61,3.3 39.37,4.06 PORT5.8
SPI3  (via drill 0.6, 0.61)  (1 unrouted)
  Top 0.3: 57.4,20.07 57.4,20.83 57.15,21.08 57.15,22.35 57.4,22.61 | 67.82,22.86 67.82,20.32 IC2.2 | v39.4,16.51 39.4,17.45 37.29,19.56 37.21,19.68 | v40.64,15.27 50.16,15.27 v50.16,19.41 | v62.08,24 62.13,23.95 62.8,23.48
  Top 0.305: IC5.3 37.47,20.73 37.47,19.94 37.21,19.68 27.43,19.68 26.96,19.22 26.61,19.61 26.15,19.54 24.97,19.46 IC4.3 U$11.2 | 57.4,22.61 60.2,22.61 62.4,23.05 62.8,23.48 63.1,23.98 64.96,24.24 66.04,23.88 67.82,22.86 | 50.16,15.27 v50.06,12.02 | 55.88,14.48 U$1.2 v55.88,13.97
  Bottom 0.3: v40.64,15.27 v39.4,16.51 | v50.16,19.41 54.36,23.6 56.39,23.6 56.41,23.62 58.29,23.62 59.69,25.02 61.06,25.02 v62.08,24
  Bottom 0.305: v50.06,12.02 51.22,8.76 53.08,8.2 54.53,8.45 54.75,9.44 54.5,11.05 54.61,11.56 v55.88,13.97
SPI4  (via drill 0.6)
  Top 0.305: IC2.5 71.18,24.77 v71.5,24.77 | v58.17,21.59 58.09,21.65 | U$12.2 U$6.2 IC4.4 25.65,18.6 25.65,17.91 25.64,16.31 26.68,15.21 26.81,15.21 v26.71,15.24 | 56.23,20.9 56.13,20.58 IC1.4 v56.12,18.55 | 56.23,20.9 56.39,21.55 | 56.23,20.9 v56.41,21.53
  Bottom 0.305: v71.5,24.77 68.45,21.59 v58.17,21.59 57.29,21.36 v56.41,21.53 | v56.12,18.55 54.92,18.73 53.57,18.75 52.82,18.22 49.98,17.88 46.62,18.77 42.32,21.52 39.97,21.15 38.05,17.94 33.08,18.27 33.01,18.23 32.26,17.73 31.07,16.78 30.16,16.59 29.38,16.85 27.29,16.93 27.24,16.66 26.81,16.66 26.8,15.92 26.8,15.3 v26.71,15.24
SPI5  (via drill 0.6)  (1 unrouted)
  Top 0.305: U$13.2 IC4.6 U$7.2 27.01,19.21 27.48,19.72 36.8,19.69 IC5.2 36.77,19.68 37.34,19.71 39.38,17.44 v39.38,16.44 | IC2.6 v68.99,23.82 | v66.77,23.48 66.47,23.64 66.3,23.76 64.93,24.24 63.06,23.97 62.53,23.11 60.2,22.63 57.43,22.61 57.14,22.3 57.17,21.05 57.4,20.87 57.45,20.51 IC1.6 | v40.64,15.24 45.19,15.25
  Bottom 0.305: v68.99,23.82 v66.77,23.48 | v39.38,16.44 v40.64,15.24
VCC  (via drill 0.6)
  Top 0.3: 45.72,24.66 R5.2
  Top 0.305: 50.8,20.32 R4.2
  Top 0.406: 70.15,42.32 68.47,40.64 52.07,40.64 50.8,39.37 50.8,25.4 | 50.8,25.4 51.42,26.02 C7.2 | IC1.1 53.76,20.32 50.8,20.32 | 50.8,20.32 50.8,25.4 | 50.8,20.32 45.72,20.32 45.72,24.66 45.72,35.56 44.45,36.83 20.32,36.83 19.05,35.56 19.05,25.4 | 19.05,25.4 19.67,24.78 C13.2 | IC4.1 23.28,19.05 19.05,19.05 19.05,25.4
  Top 0.61: v70.18,57.21 70.47,56.92 R2.1
  Top 1.016: D3.A 75.57,42.32 70.15,42.32 68.26,44.22 68.26,56.48 69,57.21 v70.18,57.21
  Bottom 0.3: C4.1 83.82,67.31 82.55,67.31 76.2,60.96 L1.2
  Bottom 1.016: L1.2 82.86,60.37 IC6.4 83.09,60.1 75.78,60.1 75.67,60 72.44,60 70.18,57.74 v70.18,57.21
VCC5  (via drill 0.6)
  Top 0.3: IC3.3 93.34,29.84 93.34,46.35 92.71,46.99 87.63,46.99 | 87.63,46.99 87.63,48.9 D5.A | 87.63,46.99 77.47,46.99 77.47,27.94 71.75,22.23 71.75,21.59 71.82,21.65
  Top 0.305: C10.1 73.55,20.83 72.64,20.83 71.82,21.65 71.5,21.97 71.5,22.73 71.37,22.86 68.45,22.86 67.94,23.37 IC2.7 IC2.8 66.61,25.4 v64.64,25.4 | v39.12,26.04 38.72,25.64 C14.1 37.49,22.9 IC5.4
  Top 0.61: R3.1 73.66,57.74 73.66,57.15 74.93,55.88 83.82,55.88 87.1,52.6 D5.A
  Bottom 0.3: C9.1 95.25,27.3 93.34,27.3 92.71,27.94 IC3.3 87,27.94 86.36,28.57 D4.C
  Bottom 0.305: v64.64,25.4 64.01,26.04 v39.12,26.04
VIN  (via drill 0.6)
  Top 0.3: IC3.1 80.64,22.86 80.64,38.1 D2.A
  Top 0.61: v72.68,50.45 v72.69,50.44 R1.1
  Bottom 0.3: IC3.1 88.27,22.86 86.36,20.95 C8.1
  Bottom 0.61: 69.86,46.51 72.68,49.32 v72.68,50.45
  Bottom 1.016: 82.43,54.29 83,54.86 IC6.1 | 80.01,52.45 82.28,50.18 C3.1
  Bottom 1.422: 78.91,46.51 79.04,46.38 79.04,39.63 D2.A
  Bottom 2.54: F2.2A 63.66,43.18 63.66,48.51 62.48,48.61 67.76,48.61 69.86,46.51 78.91,46.51 80.12,47.72 80.01,52.45 81.75,54.19 82.43,54.29

### Text on the board
Bottom: /home/eternia/Downloads/Ohw-logo.bmp
tPlace: P1 | P1 | P2 | P2 | P3 | MSP430 + RAM | P3 | MSP430 + DAC
tNames: GND | GND | GND | GND | +5V | +3.3V | SBWTCK | SBWTDIO | GND | GND | SBWTCK | SBWTDIO | +12V
tDocu: 8K FRAM
200bmp: /home/eternia/Downloads/Ohw-logo.bmp